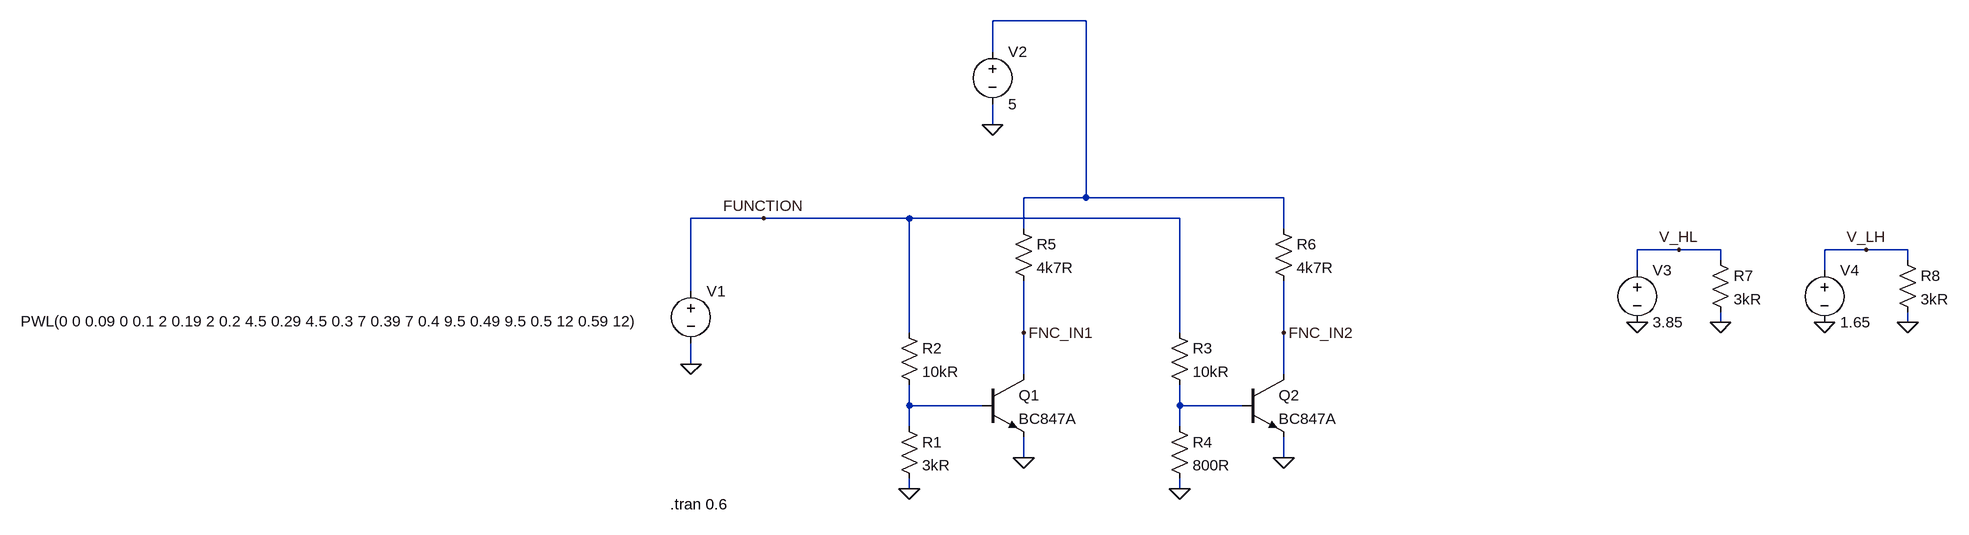
[diagram p0: schematic FUNCTION_input_circuit.asc]
FUNCTION_input_circuit.asc, the LTspice schematic file:
Version 4
SHEET 1 1620 680
WIRE 288 -304 144 -304
WIRE 144 -256 144 -304
WIRE 144 -144 144 -176
WIRE 288 -32 288 -304
WIRE 288 -32 192 -32
WIRE 592 -32 288 -32
WIRE -208 0 -320 0
WIRE 16 0 -208 0
WIRE 432 0 16 0
WIRE 192 16 192 -32
WIRE 592 16 592 -32
WIRE 1200 48 1136 48
WIRE 1264 48 1200 48
WIRE 1488 48 1424 48
WIRE 1552 48 1488 48
WIRE 1264 64 1264 48
WIRE 1552 64 1552 48
WIRE 1136 80 1136 48
WIRE 1424 80 1424 48
WIRE -320 112 -320 0
WIRE 1264 160 1264 144
WIRE 1552 160 1552 144
WIRE 16 176 16 0
WIRE 192 176 192 96
WIRE 432 176 432 0
WIRE 592 176 592 96
WIRE -320 224 -320 192
WIRE 192 240 192 176
WIRE 592 240 592 176
WIRE 16 288 16 256
WIRE 128 288 16 288
WIRE 432 288 432 256
WIRE 528 288 432 288
WIRE 16 320 16 288
WIRE 432 320 432 288
WIRE 192 368 192 336
WIRE 592 368 592 336
WIRE 16 416 16 400
WIRE 432 416 432 400
FLAG 192 368 0
FLAG 592 368 0
FLAG 16 416 0
FLAG 432 416 0
FLAG -320 224 0
FLAG 144 -144 0
FLAG 192 176 FNC_IN1
FLAG 592 176 FNC_IN2
FLAG 1136 160 0
FLAG 1424 160 0
FLAG 1264 160 0
FLAG 1552 160 0
FLAG -208 0 FUNCTION
FLAG 1200 48 V_HL
FLAG 1488 48 V_LH
SYMBOL npn 128 240 R0
SYMATTR InstName Q1
SYMATTR Value BC847A
SYMBOL npn 528 240 R0
SYMATTR InstName Q2
SYMATTR Value BC847A
SYMBOL res 0 304 R0
SYMATTR InstName R1
SYMATTR Value 3kR
SYMBOL res 0 160 R0
SYMATTR InstName R2
SYMATTR Value 10kR
SYMBOL res 416 160 R0
SYMATTR InstName R3
SYMATTR Value 10kR
SYMBOL res 416 304 R0
SYMATTR InstName R4
SYMATTR Value 800R
SYMBOL voltage -320 96 R0
WINDOW 123 0 0 Left 0
WINDOW 39 0 0 Left 0
WINDOW 3 -1031 62 Left 2
SYMATTR InstName V1
SYMATTR Value PWL(0 0 0.09 0 0.1 2 0.19 2 0.2 4.5 0.29 4.5 0.3 7 0.39 7 0.4 9.5 0.49 9.5 0.5 12 0.59 12)
SYMBOL res 176 0 R0
SYMATTR InstName R5
SYMATTR Value 4k7R
SYMBOL res 576 0 R0
SYMATTR InstName R6
SYMATTR Value 4k7R
SYMBOL voltage 144 -272 R0
WINDOW 123 0 0 Left 0
WINDOW 39 0 0 Left 0
SYMATTR InstName V2
SYMATTR Value 5
SYMBOL voltage 1136 64 R0
WINDOW 123 0 0 Left 0
WINDOW 39 0 0 Left 0
SYMATTR InstName V3
SYMATTR Value 3.85
SYMBOL voltage 1424 64 R0
WINDOW 123 0 0 Left 0
WINDOW 39 0 0 Left 0
SYMATTR InstName V4
SYMATTR Value 1.65
SYMBOL res 1248 48 R0
SYMATTR InstName R7
SYMATTR Value 3kR
SYMBOL res 1536 48 R0
SYMATTR InstName R8
SYMATTR Value 3kR
TEXT -352 440 Left 2 !.tran 0.6

The netlist it stands for:
* FUNCTION_input_circuit.asc
Q1 FNC_IN1 N002 0 0 BC847A
Q2 FNC_IN2 N003 0 0 BC847A
R1 N002 0 3kR
R2 FUNCTION N002 10kR
R3 FUNCTION N003 10kR
R4 N003 0 800R
V1 FUNCTION 0 PWL(0 0 0.09 0 0.1 2 0.19 2 0.2 4.5 0.29 4.5 0.3 7 0.39 7 0.4 9.5 0.49 9.5 0.5 12 0.59 12)
R5 N001 FNC_IN1 4k7R
R6 N001 FNC_IN2 4k7R
V2 N001 0 5
V3 V_HL 0 3.85
V4 V_LH 0 1.65
R7 V_HL 0 3kR
R8 V_LH 0 3kR
.model NPN NPN
.model PNP PNP
.lib standard.bjt
.tran 0.6
.backanno
.end